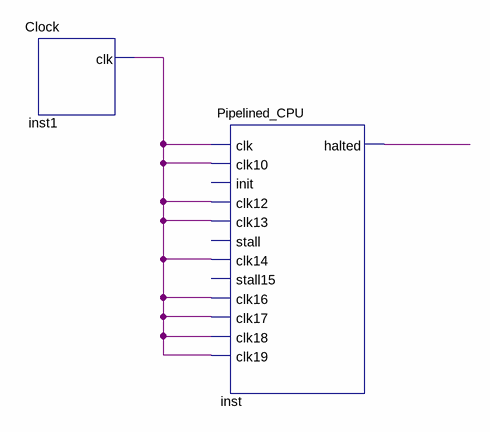
[diagram p0: schematic sheet]
// Quartus schematic top_level_pipeline_cpu.bdf as structural Verilog: 2 symbols, 0 pins
module top_level_pipeline_cpu (
);

  wire inst1_clk, inst_halted;

  Clock inst1 (.clk(inst1_clk));
  Pipelined_CPU inst (
    .clk(inst1_clk), .clk10(inst1_clk), .clk12(inst1_clk), .clk13(inst1_clk), .clk14(inst1_clk),
    .clk16(inst1_clk), .clk17(inst1_clk), .clk18(inst1_clk), .clk19(inst1_clk), .halted(inst_halted));  // open: init, stall, stall15
endmodule
